# Altium schematic sheet Coil_Driver_Rev_A_CPU_Driver.SchDoc: CPU, Driver
size B; Author: KR; Organization: OLogic, Inc.; DocumentNumber: 12282021; Revision: A; SheetNumber: 1; SheetTotal: 3; PageSetup: Record=PageOptions|CenterHorizontal=True|CenterVertical=True|PrintScale=0.95|XCorrection=1.00|YCorrection=1.00|PrintKind=1|BorderSize=5000000|LeftOffset=0|BottomOffset=0|Orientation=2|PaperLength=1000|PaperWidth=1000|Scale=100|PaperSource=7|PrintQuality=-4|MediaType=1|DitherType=10|PaperKind=Letter|PrintScaleMode=1
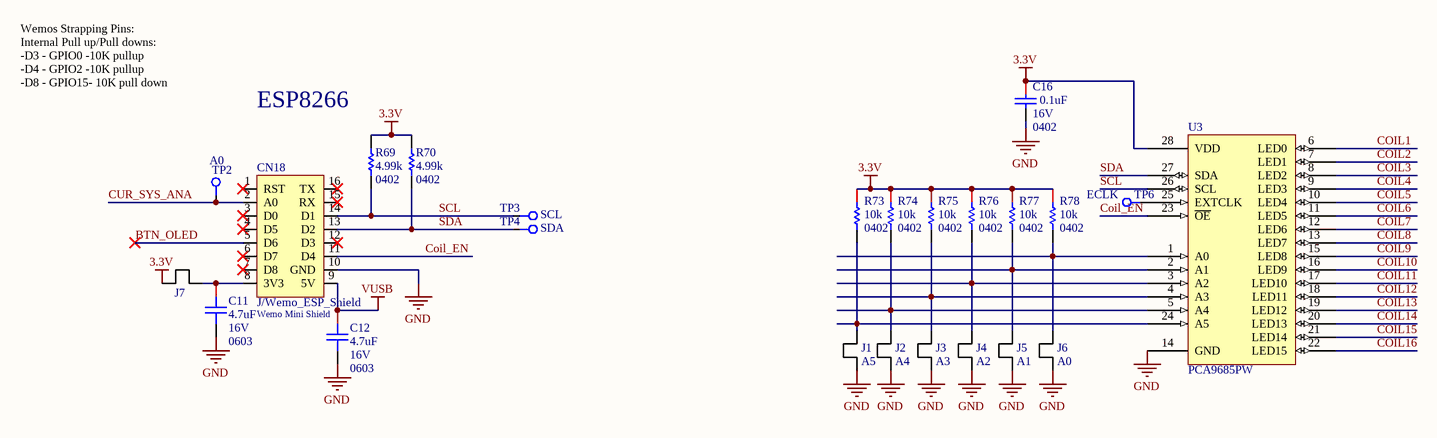
[diagram p0: Coil_Driver_Rev_A_CPU_Driver.SchDoc]

## Parts
C11  4.7uF  Voltage (Rated): 16V  Package (Imperial): 0603  [CAPC0603(1608)_L]
C12  4.7uF  Voltage (Rated): 16V  Package (Imperial): 0603  [CAPC0603(1608)_L]
C16  0.1uF  Voltage (Rated): 16V  Package (Imperial): 0402  [CAPC0402(1005)_L]
CN18  J/Wemo_ESP_Shield  Name: Wemo Mini Shield  [Wemos_d1]
J1  A5  [RESC0603(1608)_L]
J2  A4  [RESC0603(1608)_L]
J3  A3  [RESC0603(1608)_L]
J4  A2  [RESC0603(1608)_L]
J5  A1  [RESC0603(1608)_L]
J6  A0  [RESC0603(1608)_L]
J7  Sharks Tooth 0603  [RESC0603(1608)_L]  (value not drawn)
R69  Resistance (Ohms): 4.99k  Package / Case: 0402  [RESC0402(1005)_N]  (hidden comment: 4.99K 1%)
R70  Resistance (Ohms): 4.99k  Package / Case: 0402  [RESC0402(1005)_N]  (hidden comment: 4.99K 1%)
R73  Resistance: 10k  Case Code (Imperial): 0402  [RESC0402(1005)_L]  (hidden comment: RES 10K OHM 0.1% 1/16W 0402)
R74  Resistance: 10k  Case Code (Imperial): 0402  [RESC0402(1005)_L]  (hidden comment: RES 10K OHM 0.1% 1/16W 0402)
R75  Resistance: 10k  Case Code (Imperial): 0402  [RESC0402(1005)_L]  (hidden comment: RES 10K OHM 0.1% 1/16W 0402)
R76  Resistance: 10k  Case Code (Imperial): 0402  [RESC0402(1005)_L]  (hidden comment: RES 10K OHM 0.1% 1/16W 0402)
R77  Resistance: 10k  Case Code (Imperial): 0402  [RESC0402(1005)_L]  (hidden comment: RES 10K OHM 0.1% 1/16W 0402)
R78  Resistance: 10k  Case Code (Imperial): 0402  [RESC0402(1005)_L]  (hidden comment: RES 10K OHM 0.1% 1/16W 0402)
TP2  A0  [Pogo-Testpoint]  (no BOM)
TP3  SCL  [Pogo-Testpoint]  (no BOM)
TP4  SDA  [Pogo-Testpoint]  (no BOM)
TP6  ECLK  [Pogo-Testpoint]  (no BOM)
U3  PCA9685PW  [TSOP65P640X110-28N]

## Nets
3.3V: C16.1 J7.1 R69.2 R70.2 R73.1 R74.1 R75.1 R76.1 R77.1 R78.1 U3.28(VDD)
GND: C11.2 C12.2 C16.2 CN18.10(GND) J1.1 J2.1 J3.1 J4.1 J5.1 J6.1 U3.14(GND)
VUSB: C12.1 CN18.9(5V)
BTN_OLED: CN18.5(D6)
COIL1: U3.6(LED0)
COIL2: U3.7(LED1)
COIL3: U3.8(LED2)
COIL4: U3.9(LED3)
COIL5: U3.10(LED4)
COIL6: U3.11(LED5)
COIL7: U3.12(LED6)
COIL8: U3.13(LED7)
COIL9: U3.15(LED8)
COIL10: U3.16(LED9)
COIL11: U3.17(LED10)
COIL12: U3.18(LED11)
COIL13: U3.19(LED12)
COIL14: U3.20(LED13)
COIL15: U3.21(LED14)
COIL16: U3.22(LED15)
Coil_EN: CN18.11(D4) U3.23(~{OE})
CUR_SYS_ANA: CN18.2(A0) TP2.1
SCL: CN18.14(D1) R69.1 TP3.1 U3.26(SCL)
SDA: CN18.13(D2) R70.1 TP4.1 U3.27(SDA)
NetC11_1: C11.1 CN18.8(3V3) J7.2
NetJ1_2: J1.2 R73.2 U3.24(A5)
NetJ2_2: J2.2 R74.2 U3.5(A4)
NetJ3_2: J3.2 R75.2 U3.4(A3)
NetJ4_2: J4.2 R76.2 U3.3(A2)
NetJ5_2: J5.2 R77.2 U3.2(A1)
NetJ6_2: J6.2 R78.2 U3.1(A0)
NetTP6_1: TP6.1 U3.25(EXTCLK)

Not connected (* = marked no-connect by the designer): CN18 1(RST)* 3(D0)* 4(D5)* 6(D7)* 7(D8)* 12(D3)* 15(RX)* 16(TX)*

## Notes on the sheet
- Wemos Strapping Pins:
  Internal Pull up/Pull downs:
  -D3 - GPIO0 -10K pullup
  -D4 - GPIO2 -10K pullup
  -D8 - GPIO15- 10K pull down
- (near R69) ESP8266
- Title
- By:
- Date:
- Number:
- Time:
- Revision:
- Sheet
- of
- OLogic, Inc.
- 3350 Scott Blvd. Bldg 47
- Santa Clara, CA
- 95054 USA
- File:
- (650) 996-1490

## Library data of the parts
C11 C12 = CMP-001-0597-12: CAP CER 4.7uF 16V X5R 0603; Capacitance: 4.7µF; Dielectric Material: Ceramic; Package (Metric): 1608; Tolerance: 10%; Temperature (Max): 85°C; Temperature (Min): -55°C; Length: 1.6mm; Mounting Type: SMD; Height: 800µm; Temperature Coefficient: X5R
C16 = CMP-001-0605-16: CAP CER 0.1UF 16v X7R 0402; Temperature (Min): -55°C; Temperature (Max): 85°C; Tolerance: 10%; Capacitance: 100nF; Package (Metric): 1005; Dielectric Material: Ceramic; Height: 500µm; Temperature Coefficient: X7R; Mounting Type: SMD; Length: 1mm
CN18 = J/Wemo_ESP_Shield: Wemo Mini Shield for ESP-12
J1-J7 = CMP-001-1242-02: Solderable jumper for connecting things
R69 R70 = RES 4.99K OHM 1% 1/10W 0402: 4.99K 0402; Manufacturer: Panasonic Electronic Components; Manufacturer Part Number: ERJ-2RKF4991X; Power (Watts): 0.1W, 1/10W; Temperature Coefficient: ±100ppm/°C; Supplier 1: Digi-Key; RoHS: RoHS Compliant; Category: Resistors; Stock 1: 765320; Pricing 1: 1=0.1, 50=0.0196, 100=0.0149, 250=0.01104, 500=0.00816, 1000=0.00544, 5000=0.00383 (USD); Packaging: Cut Tape (CT); Tolerance: ±1%; Composition: Thick Film; Features: Automotive AEC-Q200; Operating Temperature: -55°C ~ 155°C; Supplier Device Package: 0402; Size / Dimension: 0.039" L x 0.020" W (1.00mm x 0.50mm); Height: 0.016" (0.40mm); Number of Terminations: 2; ComponentLink1URL: http://industrial.panasonic.com/www-cgi/jvcr13pz.cgi?E+PZ+3+AOA0002+ERJ2RKF4991X+7+WW; ComponentLink1Description: http://industrial.panasonic.com/www-cgi/jvcr13pz.cgi?E+PZ+3+AOA0002+ERJ2RKF4991X+7+WW; Supplier Part Number 1: P4.99KLCT-ND
R73-R78 = CMP-001-0950-02: 10 kOhms ±0.1% 0.063W, 1/16W Chip Resistor 0402 (1005 Metric) Automotive AEC-Q200 Thin Film; Temperature Coefficient: 25ppm/°C; Max Power Dissipation: 63mW; Length: 0.039inch; Max Operating Temperature: 155°C; Min Operating Temperature: -55°C; Case/Package: 0402; Packaging: Tape and Reel; Tolerance: 0.1%; Width: 0.02inch; Contact Plating: Tin,Matte; Height: 0.016inch; Composition: Thin Film; Case Code (Metric): 1005; Package Quantity: 10000; Mount: Surface Mount; Radiation Hardening: No; Number of Terminations: 2; Features: Moisture Resistant
TP2-TP4 TP6 = CMP-001-0557-03: Test Point- Current one; Pin Count: 1; Component Name: TestPoint; Designator: TestPoint
U3 = CMP-001-1815-01: IC LED DRVR LIN DIM 25MA 28TSSOP / LED Driver 10000uA Supply Current 28-Pin TSSOP; High Level Output Current: 10mA; Output Voltage: 5.5V; Min Supply Voltage: 2.3V; Supply Current: 10A; Power Dissipation: 400W; Switching Frequency: 1MHz; Number of Outputs: 16; Low Level Output Current: 400A; Case/Package: TSSOP; Min Operating Temperature: -40°C; Max Input Voltage: 5.5V; Max Supply Voltage: 5.5V; Packaging: Tape and Reel; Max Output Voltage: 5.5V; Radiation Hardening: No; Max Output Current: 25mA; Output Current: 25mA; Max Operating Temperature: 85°C; Mount: Surface Mount; RoHS Compliant: Yes; REACH SVHC: No SVHC; Nominal Supply Current: 10A; Number of Pins: 28; Min Input Voltage: 2.3V